# EAGLE design spektrum-to-ppm (EAGLE 5.12)
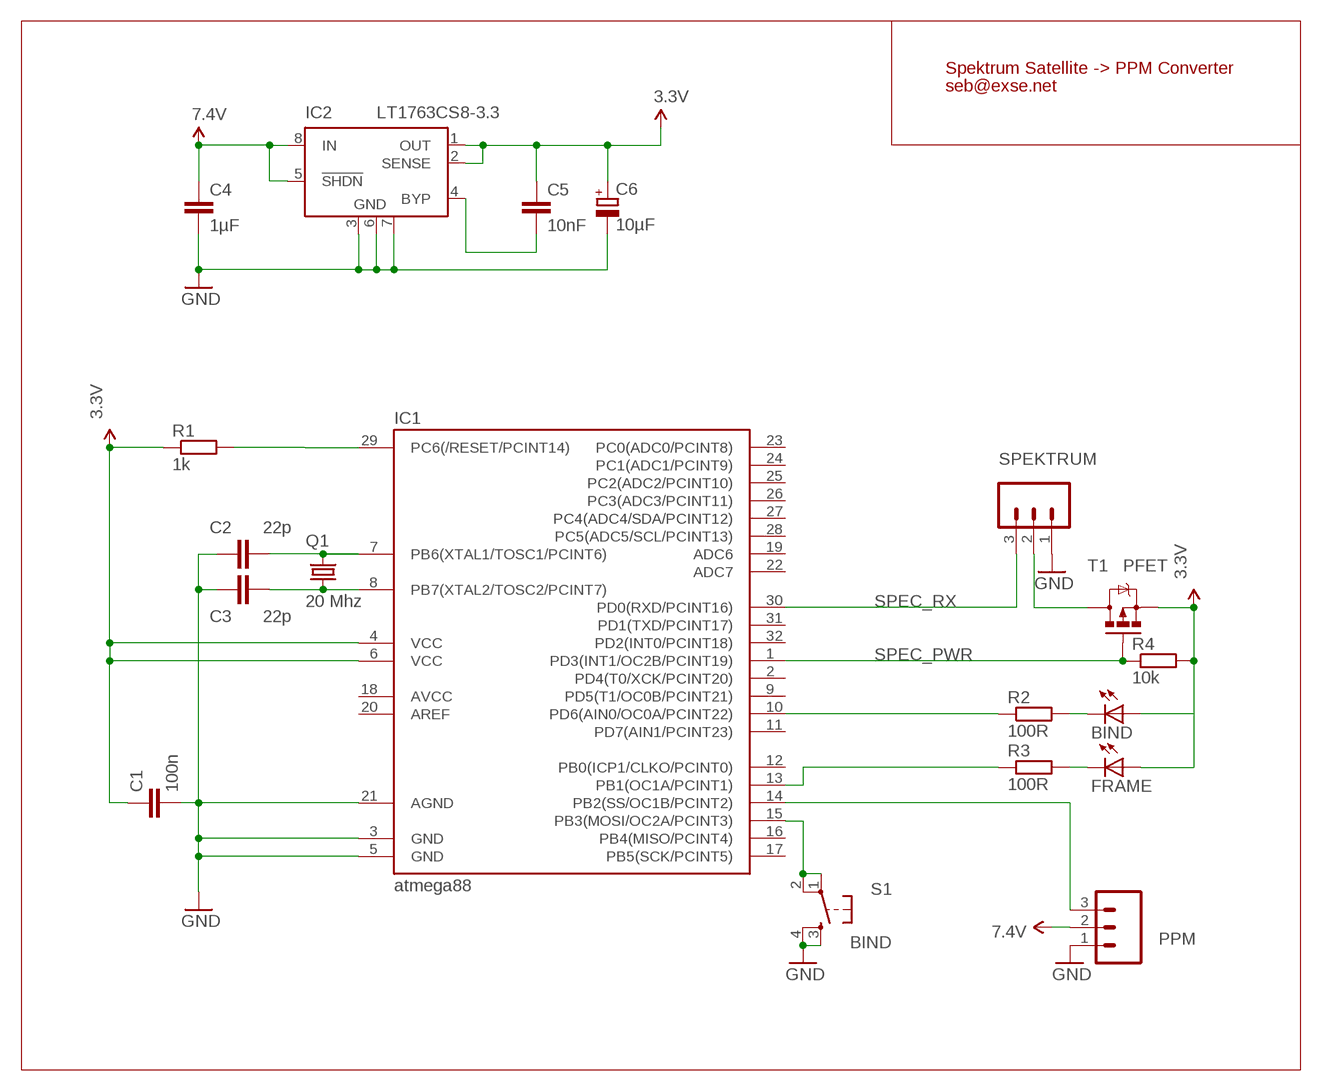
[diagram p0: schematic, sheet 1]

## Parts
BIND  LEDCHIPLED_0805  [CHIPLED_0805]
C1  100n  CAP0805  [0805]
C2  22p  C-EUC0402  [C0402]
C3  22p  C-EUC0402  [C0402]
C4  1µF  CAP0805  [0805]
C5  10nF  C-EUC0402  [C0402]
C6  10µF  CPOL-EUSMCC  [SMC_C]
FRAME  LEDCHIPLED_0805  [CHIPLED_0805]
IC1  atmega88  MEGA48/88/168-AU  [TQFP32-08]
IC2  LT1763CS8-3.3  [SOIC8]
PPM  M03LONGPADS  [1X03_LONGPADS]
Q1  20 Mhz  X22-OSCILLATOR  [X22]
R1  1k  R-EU_R0402  [R0402]
R2  100R  R-EU_R0402  [R0402]
R3  100R  R-EU_R0402  [R0402]
R4  10k  R-EU_R0402  [R0402]
S1  BIND  TAC_SWITCHSMD  [TACTILE_SWITCH_SMD]
SPEKTRUM  M03LONGPADS  [1X03_LONGPADS]
T1  PFET  MOSFET-PCHANNEL  [SOT23]

## Nets
3.3V: BIND.A C1.1 C5.1 C6.+ FRAME.A IC1.4(VCC) IC1.6(VCC) IC2.1(OUT) IC2.2(SENSE) R1.1 T1.2(S)
5V: C4.1 IC2.5(!SHDN) IC2.8(IN) PPM.2 ; supply symbol labelled 7.4V
GND: C1.2 C2.1 C3.1 C4.2 C6.- IC1.3(GND) IC1.5(GND) IC1.21(AGND) IC2.3(GND) IC2.6(GND) IC2.7(GND) PPM.1 S1.3 S1.4 SPEKTRUM.1
N$1: C5.2 IC2.4(BYP)
N$2: IC1.15(PB3(MOSI/OC2A/PCINT3)) S1.1 S1.2
N$3: SPEKTRUM.2 T1.3(D)
N$4: IC1.14(PB2(SS/OC1B/PCINT2)) PPM.3
N$5: R4.2
N$6: BIND.C R2.2
N$8: IC1.29(PC6(/RESET/PCINT14)) R1.2
N$9: C3.2 IC1.8(PB7(XTAL2/TOSC2/PCINT7)) Q1.1
N$10: C2.2 IC1.7(PB6(XTAL1/TOSC1/PCINT6)) Q1.3
N$11: IC1.10(PD6(AIN0/OC0A/PCINT22)) R2.1
N$14: FRAME.C R3.2
N$15: IC1.13(PB1(OC1A/PCINT1)) R3.1
SPEC_PWR: IC1.1(PD3(INT1/OC2B/PCINT19)) R4.1 T1.1(G)
SPEC_RX: IC1.30(PD0(RXD/PCINT16)) SPEKTRUM.3
Unconnected: IC1.2(PD4(T0/XCK/PCINT20)) IC1.9(PD5(T1/OC0B/PCINT21)) IC1.11(PD7(AIN1/PCINT23)) IC1.12(PB0(ICP1/CLKO/PCINT0)) IC1.16(PB4(MISO/PCINT4)) IC1.17(PB5(SCK/PCINT5)) IC1.18(AVCC) IC1.19(ADC6) IC1.20(AREF) IC1.22(ADC7) IC1.23(PC0(ADC0/PCINT8)) IC1.24(PC1(ADC1/PCINT9)) IC1.25(PC2(ADC2/PCINT10)) IC1.26(PC3(ADC3/PCINT11)) IC1.27(PC4(ADC4/SDA/PCINT12)) IC1.28(PC5(ADC5/SCL/PCINT13)) IC1.31(PD1(TXD/PCINT17)) IC1.32(PD2(INT0/PCINT18))

## Notes on the sheet
- Spektrum Satellite -> PPM Converter
- seb@exse.net

## Library data of the parts
BIND FRAME = led:LED: LED OSRAM: - CHIPLED LG R971, LG N971, LY N971, LG Q971, LY Q971, LO R971, LY R971 LH N974, LH R974 LS Q976, LO Q976, LY Q976 LO Q996 - Hyper CHIPLED LW Q18S LB Q993, LB Q99A, LB R99A - SideLED LS A670, LO A670, LY A670, LG A670, LP A670 LB A673, LV A673, LT A673, LW A673 LH A674 LY A675 LS A676, LA A676, LO A676, LY A676, LW A676 LS A679, LY A679, LG A679 - Hyper Micro SIDELED® LS Y876, LA Y876, LO Y876, LY Y876 LT Y87S - SmartLED LW L88C, LW L88S LB L89C, LB L89S, LG L890 LS L89K, LO L89K, LY L89K LS L896, LA L896, LO L896, LY L896 - TOPLED LS T670, LO T670, LY T670, LG T670, LP T670 LSG T670, LSP T670, LSY T670, LOP T670, LYG T670 LG T671, LOG T671, LSG T671 LB T673, LV T673, LT T673, LW T673 LH T674 LS T676, LA T676, LO T676, LY T676, LB T676, LH T676, LSB T676, LW T676 LB T67C, LV T67C, LT T67C, LS T67K, LO T67K, LY T67K, LW E67C LS E67B, LA E67B, LO E67B, LY E67B, LB E67C, LV E67C, LT E67C LW T67C LS T679, LY T679, LG T679 LS T770, LO T770, LY T770, LG T770, LP T770 LB T773, LV T773, LT T773, LW T773 LH T774 LS E675, LA E675, LY E675, LS T675 LS T776, LA T776, LO T776, LY T776, LB T776 LHGB T686 LT T68C, LB T68C - Hyper Mini TOPLED® LB M676 - Mini TOPLED Santana® LG M470 LS M47K, LO M47K, LY M47K Source: http://www.osram.convergy.de LUXEON: - LUMILED® LXK2-PW12-R00, LXK2-PW12-S00, LXK2-PW14-U00, LXK2-PW14-V00 LXK2-PM12-R00, LXK2-PM12-S00, LXK2-PM14-U00 LXK2-PE12-Q00, LXK2-PE12-R00, LXK2-PE12-S00, LXK2-PE14-T00, LXK2-PE14-U00 LXK2-PB12-K00, LXK2-PB12-L00, LXK2-PB12-M00, LXK2-PB14-N00, LXK2-PB14-P00, LXK2-PB14-Q00 LXK2-PR12-L00, LXK2-PR12-M00, LXK2-PR14-Q00, LXK2-PR14-R00 LXK2-PD12-Q00, LXK2-PD12-R00, LXK2-PD12-S00 LXK2-PH12-R00, LXK2-PH12-S00 LXK2-PL12-P00, LXK2-PL12-Q00, LXK2-PL12-R00 Source: www.luxeon.com KINGBRIGHT: KA-3528ASYC Source: www.kingbright.com
C1 C4 = SparkFun:CAP: Capacitor Standard 0603 ceramic capacitor, and 0.1" leaded capacitor.
C2 C3 C5 = rcl:C-EU: CAPACITOR, European symbol
C6 = resistor:CPOL-EU: POLARIZED CAPACITOR, European symbol
IC1 = avr-4:MEGA48/88/168
IC2 = linear-technology:LT1763CS8: 500mA, Low Noise, LDO Micropower Regulators Source: http://cds.linear.com/docs/Datasheet/1763ff.pdf
PPM SPEKTRUM = SparkFun:M03: Header 3 Standard 3-pin 0.1" header. Use with straight break away headers (SKU : PRT-00116), right angle break away headers (PRT-00553), swiss pins (PRT-00743), machine pins (PRT-00117), and female headers (PRT-00115). Molex polarized connector foot print use with SKU : PRT-08232 with associated crimp pins and housings.
Q1 = seb:X22-OSCILLATOR
R1-R4 = rcl:R-EU_: RESISTOR, European symbol
S1 = SparkFun:TAC_SWITCH: Momentary Switch Button commonly used for reset or general input. Spark Fun Electronics SKU : COM-00097
T1 = SparkFun:MOSFET-PCHANNEL

## Board
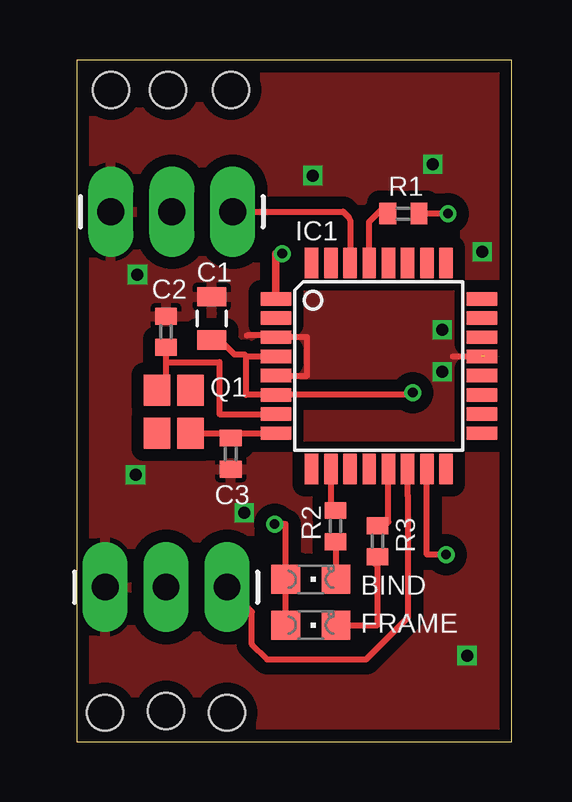
[diagram p1: board, top side]
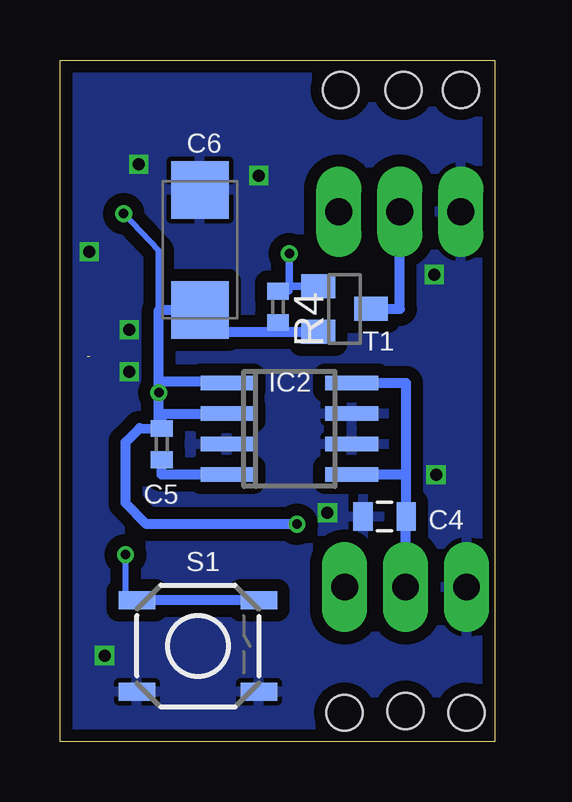
[diagram p2: board, bottom side, seen from below]

Size 18.12 x 28.4 mm. Coordinates in mm from the lower left corner, seen from the top.
Outline: 0,0 18.12,0 18.12,28.4 0,28.4 0,0
Copper layers (1*16): Top 0.035mm / dielectric 1.5mm / Bottom 0.035mm
Design rules "PCB-POOL Standard *": minimum track width 0.15mm, minimum drill 0.3mm, track to track 0.15mm, track to pad 0.15mm, pad to pad 0.15mm, via to via 0.15mm, smd to smd 0.15mm, copper to edge 0.1mm, drill to drill 0.2mm, minimum pad ring 0.2mm, minimum via ring 0.15mm, stop-mask expansion 0.075mm, vias tented up to drill 30mil, thermal gap 0.2mm
Holes 1.5 mm at 1.18,1.2 3.72,1.28 6.26,1.2 1.42,27.16 3.8,27.16 6.42,27.16

### Footprints (pad centres in the part's own frame; a part is rotated, then mirrored left to right if it is on the bottom)
CHIPLED_0805 = smd 1.2 x 1.2: A 0,-1.05; C 0,1.05
0805 = smd 0.8 x 1.2: 1 -0.9,0; 2 0.9,0
C0402 = smd 0.7 x 0.9: 1 -0.65,0; 2 0.65,0
SMC_C = smd 2.4 x 2.4: + -2.5,0; - 2.5,0
TQFP32-08 = smd 1.27 x 0.559: 1 -4.293,2.8; 2 -4.293,2; 3 -4.293,1.2; 4 -4.293,0.4; 5 -4.293,-0.4; 6 -4.293,-1.2; 7 -4.293,-2; 8 -4.293,-2.8; 17 4.293,-2.8; 18 4.293,-2; 19 4.293,-1.2; 20 4.293,-0.4; 21 4.293,0.4; 22 4.293,1.2; 23 4.293,2; 24 4.293,2.8 | smd 0.559 x 1.27: 9 -2.8,-4.293; 10 -2,-4.293; 11 -1.2,-4.293; 12 -0.4,-4.293; 13 0.4,-4.293; 14 1.2,-4.293; 15 2,-4.293; 16 2.8,-4.293; 25 2.8,4.293; 26 2,4.293; 27 1.2,4.293; 28 0.4,4.293; 29 -0.4,4.293; 30 -1.2,4.293; 31 -2,4.293; 32 -2.8,4.293
SOIC8 = smd 0.6 x 2.2: 1 -1.905,-2.6; 2 -0.635,-2.6; 3 0.635,-2.6; 4 1.905,-2.6; 5 1.905,2.6; 6 0.635,2.6; 7 -0.635,2.6; 8 -1.905,2.6
1X03_LONGPADS = drill 1.118 pad 1.88 long: 1 0,0; 2 2.54,0; 3 5.08,0
X22 = smd 1.3 x 1.1: 1 0.9,0.7; 2 -0.9,0.7; 3 -0.9,-0.7; 4 0.9,-0.7
R0402 = smd 0.7 x 0.9: 1 -0.65,0; 2 0.65,0
TACTILE_SWITCH_SMD = smd 1.524 x 0.762: 1 -2.54,1.905; 2 2.54,1.905; 3 -2.54,-1.905; 4 2.54,-1.905
SOT23 = smd 1 x 1.4: 1 -0.95,-1.1; 2 0.95,-1.1; 3 0,1.1

### Placement (x,y rotation side)
BIND  9.75,6.76 270 top
C1  5.62,17.63 90 top
C2  3.72,17.08 270 top
C3  6.41,12 90 top
C4  4.59,9.38 180 bottom
C5  13.88,12.39 270 bottom
C6  12.29,20.49 90 bottom
FRAME  9.75,4.85 270 top
IC1  12.58,15.65 0 top
IC2  8.56,13.03 270 bottom
PPM  1.18,6.44 0 top
Q1  4.04,13.74 270 top
R1  13.61,22 180 top
R2  10.78,8.98 270 top
R3  12.53,8.35 270 top
R4  9.04,18.11 270 bottom
S1  12.37,3.98 0 bottom
SPEKTRUM  1.42,22.08 0 top
T1  6.26,18.03 270 bottom

### Tracks (layer width: path | path; a pad name or v marks a point on that pad's centre or on a via)
3.3V  (via drill 0.4)
  Top 0.254: 7.05,16.05 IC1.4 | 7.05,16.05 7.05,14.45 IC1.6 14,14.45 v14,14.54 | R1.1 14.74,22 v15.47,22 | 7.05,16.05 6.98,16.12 6.58,16.12 5.97,16.73 C1.1 | v8.24,9.06 8.7,9.06 BIND.A FRAME.A
  Bottom 0.254: v15.47,22 14,20.45 14,17.71
  Bottom 0.406: 13.88,13.66 C5.1 14.8,13.06 15.39,12.47 15.39,9.93 14.51,9.06 v8.24,9.06 | 13.88,13.66 IC2.2 | 14,15.01 v14,14.54 14,13.27 13.88,13.66 | IC2.1 11.16,15.01 14,15.01 | 14,15.01 14,17.71 14,17.99 C6.+ 12.29,17.08 8.88,17.08 | 8.88,17.08 T1.2 | 8.88,17.08 8.88,17.46
5V
  Bottom 0.406: PPM.2 3.72,9.35 C4.1 3.69,11.12 | 3.69,11.12 IC2.5 | IC2.8 3.69,14.93 3.69,11.12
GND  (via drill 0.5)  (1 unrouted)
  Top 0.254: IC1.5 9.59,15.25 9.59,16.85 IC1.3 8.24,16.9 8.24,16.93 | 8.24,16.93 8.4,16.93 | 8.24,16.93 7.1,16.93 | 15.67,16.05 16.97,16.05
  Top 0.406: PPM.1 1.18,7.47
  other vias: 2.53,19.46 15.23,15.41 15.23,17.16 16.9,20.41 9.83,23.59 14.83,24.06 2.45,11.12 6.97,9.54 16.26,3.58
  pour Bottom (isolate 0.508): 0.07,28.51 17.85,28.51 17.85,-0.23 0.07,-0.23
  pour Top (isolate 0.508): -0.09,28.51 17.69,28.51 17.69,-0.23 -0.09,-0.23
N$1
  Bottom 0.406: C5.2 13.88,11.12 IC2.4
N$2  (via drill 0.4)
  Top 0.254: v15.39,7.79 14.58,7.79 IC1.15
  Bottom 0.254: S1.1 15.39,5.89 v15.39,7.79
  Bottom 0.406: S1.2 S1.1
N$3
  Bottom 0.406: T1.3 3.96,18.03 SPEKTRUM.2
N$4
  Top 0.254: IC1.14 13.78,10.25 13.8,10.25 13.8,6.12 13.8,5.17 12.05,3.42 7.93,3.42 7.29,4.06 7.29,5.41 PPM.3
N$6
  Top 0.254: BIND.C 10.78,6.76 R2.2
N$8
  Top 0.254: R1.2 12.77,22.24 12.18,21.65 IC1.29
N$9
  Top 0.254: 6.65,12.85 C3.2 | 6.65,12.85 IC1.8 | Q1.1 5.21,12.85 6.65,12.85
N$10
  Top 0.254: Q1.3 3.72,14.17 3.72,15.81 | IC1.7 5.94,13.65 5.94,15.81 3.72,15.81 | 3.72,15.81 C2.2
N$11
  Top 0.254: R2.1 10.58,9.63 IC1.10
N$14
  Top 0.254: 12.42,7.39 R3.2 12.53,4.85 FRAME.C
N$15
  Top 0.254: R3.1 12.98,9.14 IC1.13
SPEC_PWR  (via drill 0.4)
  Top 0.305: v8.56,20.33 8.29,20.33 IC1.1
  Bottom 0.254: R4.1 8.56,18.76 8.56,19.22
  Bottom 0.305: T1.1 8.56,18.98 8.56,19.22 v8.56,20.33
SPEC_RX
  Top 0.254: SPEKTRUM.3 11.1,22.08 11.34,21.84 11.38,21.73 IC1.30

### Text on the board
tStop: Spektrum | seb@exse.net | PPM
bStop: - | + | s | - | + | s